# Altium schematic sheet LEDs.SchDoc
size A3
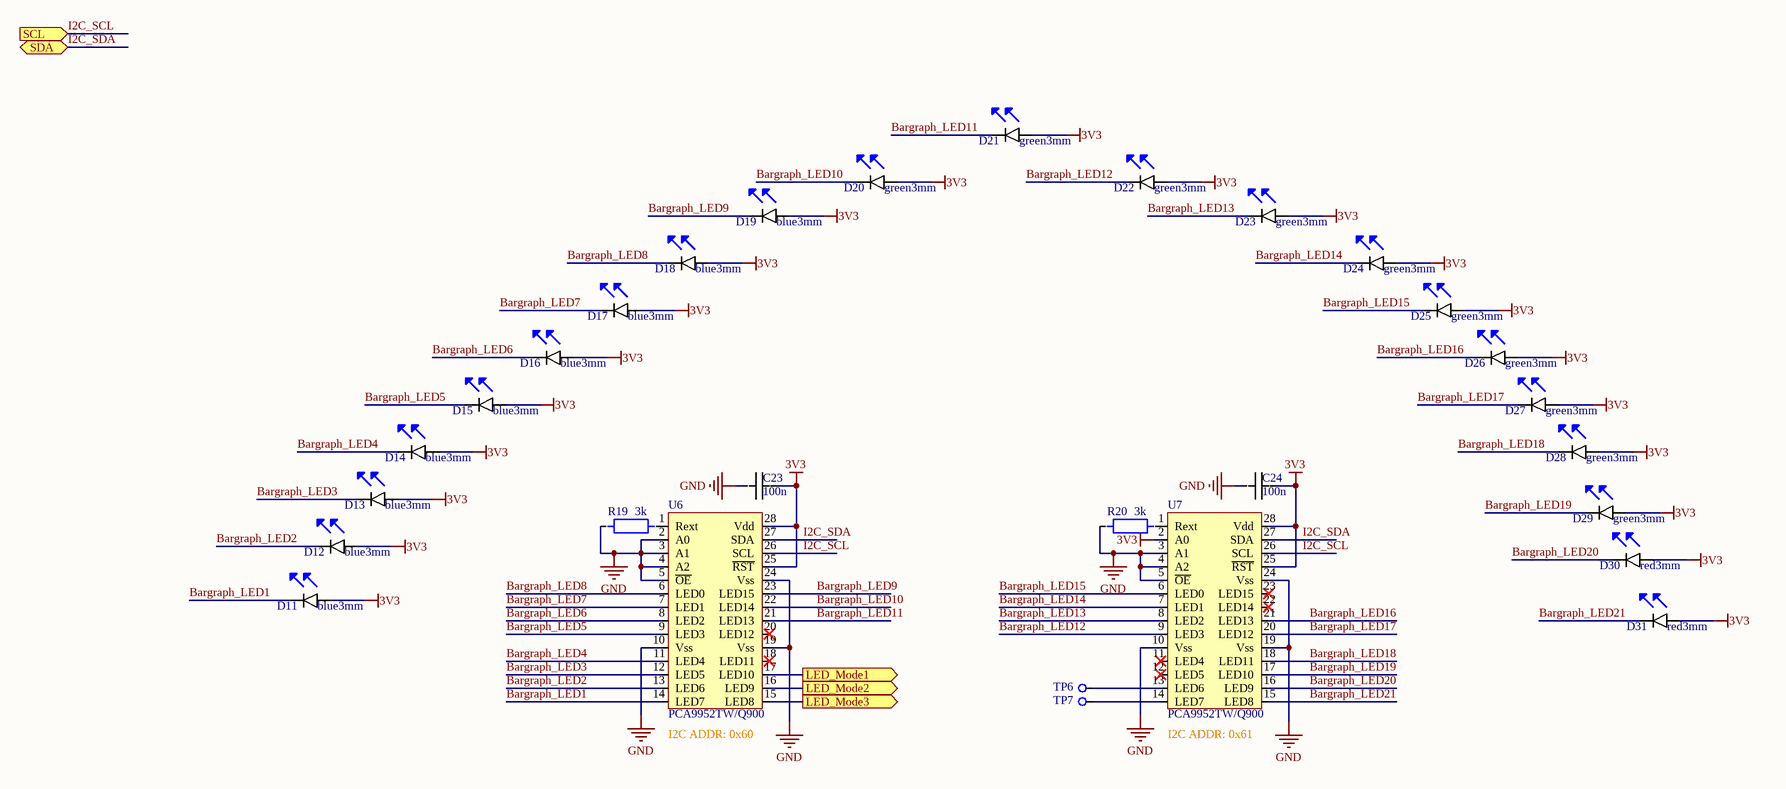
[diagram p0: LEDs.SchDoc]

## Parts
C23  100n  [0402_]
C24  100n  [0402_]
D11  color_diam: blue3mm  [LED3MM_BLUE]  (hidden comment: led)
D12  color_diam: blue3mm  [LED3MM_BLUE]  (hidden comment: led)
D13  color_diam: blue3mm  [LED3MM_BLUE]  (hidden comment: led)
D14  color_diam: blue3mm  [LED3MM_BLUE]  (hidden comment: led)
D15  color_diam: blue3mm  [LED3MM_BLUE]  (hidden comment: led)
D16  color_diam: blue3mm  [LED3MM_BLUE]  (hidden comment: led)
D17  color_diam: blue3mm  [LED3MM_BLUE]  (hidden comment: led)
D18  color_diam: blue3mm  [LED3MM_BLUE]  (hidden comment: led)
D19  color_diam: blue3mm  [LED3MM_BLUE]  (hidden comment: led)
D20  color_diam: green3mm  [LED3MM_GREEN]  (hidden comment: led)
D21  color_diam: green3mm  [LED3MM_GREEN]  (hidden comment: led)
D22  color_diam: green3mm  [LED3MM_GREEN]  (hidden comment: led)
D23  color_diam: green3mm  [LED3MM_GREEN]  (hidden comment: led)
D24  color_diam: green3mm  [LED3MM_GREEN]  (hidden comment: led)
D25  color_diam: green3mm  [LED3MM_GREEN]  (hidden comment: led)
D26  color_diam: green3mm  [LED3MM_GREEN]  (hidden comment: led)
D27  color_diam: green3mm  [LED3MM_GREEN]  (hidden comment: led)
D28  color_diam: green3mm  [LED3MM_GREEN]  (hidden comment: led)
D29  color_diam: green3mm  [LED3MM_GREEN]  (hidden comment: led)
D30  color_diam: red3mm  [LED3MM_RED]  (hidden comment: led)
D31  color_diam: red3mm  [LED3MM_RED]  (hidden comment: led)
R19  3k  [0402_]
R20  3k  [0402_]
TP6  TP  [TP_PogoPin]  (value not drawn)  (no BOM)
TP7  TP  [TP_PogoPin]  (value not drawn)  (no BOM)
U6  PCA9952TW/Q900  [HTSSOP28]
U7  PCA9952TW/Q900  [HTSSOP28]

## Ports
LED_Mode1 (out), LED_Mode2 (out), LED_Mode3 (out), SCL (in), SDA (bidir)

## Nets
3V3: C23.1 C24.1 D11.1 D12.1 D13.1 D14.1 D15.1 D16.1 D17.1 D18.1 D19.1 D20.1 D21.1 D22.1 D23.1 D24.1 D25.1 D26.1 D27.1 D28.1 D29.1 D30.1 D31.1 U6.25(~{RST}) U6.28(Vdd) U7.2(A0) U7.25(~{RST}) U7.28(Vdd)
GND: C23.2 C24.2 R19.1 R20.1 U6.2(A0) U6.3(A1) U6.4(A2) U6.5(~{OE}) U6.10(Vss) U6.19(Vss) U6.24(Vss) U7.3(A1) U7.4(A2) U7.5(~{OE}) U7.10(Vss) U7.19(Vss) U7.24(Vss)
Bargraph_LED1: D11.2 U6.14(LED7)
Bargraph_LED2: D12.2 U6.13(LED6)
Bargraph_LED3: D13.2 U6.12(LED5)
Bargraph_LED4: D14.2 U6.11(LED4)
Bargraph_LED5: D15.2 U6.9(LED3)
Bargraph_LED6: D16.2 U6.8(LED2)
Bargraph_LED7: D17.2 U6.7(LED1)
Bargraph_LED8: D18.2 U6.6(LED0)
Bargraph_LED9: D19.2 U6.23(LED15)
Bargraph_LED10: D20.2 U6.22(LED14)
Bargraph_LED11: D21.2 U6.21(LED13)
Bargraph_LED12: D22.2 U7.9(LED3)
Bargraph_LED13: D23.2 U7.8(LED2)
Bargraph_LED14: D24.2 U7.7(LED1)
Bargraph_LED15: D25.2 U7.6(LED0)
Bargraph_LED16: D26.2 U7.21(LED13)
Bargraph_LED17: D27.2 U7.20(LED12)
Bargraph_LED18: D28.2 U7.18(LED11)
Bargraph_LED19: D29.2 U7.17(LED10)
Bargraph_LED20: D30.2 U7.16(LED9)
Bargraph_LED21: D31.2 U7.15(LED8)
I2C_SCL: U6.26(SCL) U7.26(SCL) ; port SCL
I2C_SDA: U6.27(SDA) U7.27(SDA) ; port SDA
LED_Mode1: U6.17(LED10) ; port LED_Mode1
LED_Mode2: U6.16(LED9) ; port LED_Mode2
LED_Mode3: U6.15(LED8) ; port LED_Mode3
NetR19_2: R19.2 U6.1(Rext)
NetR20_2: R20.2 U7.1(Rext)
NetTP6_1: TP6.1 U7.13(LED6)
NetTP7_1: TP7.1 U7.14(LED7)

Not connected (* = marked no-connect by the designer): U6 18(LED11)* 20(LED12)*; U7 11(LED4)* 12(LED5)* 22(LED14)* 23(LED15)*

## Notes on the sheet
- (near U6) I2C ADDR: 0x60
- (near U7) I2C ADDR: 0x61

## Library data of the parts
C23 C24 = C: Manufacturer PartNum: C1005X5R1E104K050BC; Manufacturer: TDK Corp; value: 100n; Digikey ref: 445-4964-1-ND
D11-D19 = led: Manufacturer: Wuerth; Manufacturer PartNum: 151033BS03000; type: BLUE, 2.8V/20mA/3800mcd/3mm; Digikey ref: 732-5011-ND
D20-D29 = led: Manufacturer: Kingbright; Manufacturer PartNum: WP710A10LZGCK; type: GREEN, 2.65V/2mA/1100mcd/3mm; Digikey ref: 754-1915-ND
D30 D31 = led: Manufacturer: Wuerth; Manufacturer PartNum: 151033RS03000; type: RED, 2V/20mA/2600mcd/3mm; Digikey ref: 732-5013-ND
R19 R20 = R: Manufacturer PartNum: RC0402FR-073KL; Manufacturer: Yageo; value: 3k; Digikey ref: 311-3KLRCT-ND
U6 U7 = PCA9952TW/Q900: Manufacturer: NXP; Manufacturer PartNum: PCA9952TW/Q900,118; Digikey ref: 568-10954-1-ND; Farnell ref: *; status: *